# EAGLE design DAQ5 (EAGLE 9.6.2)
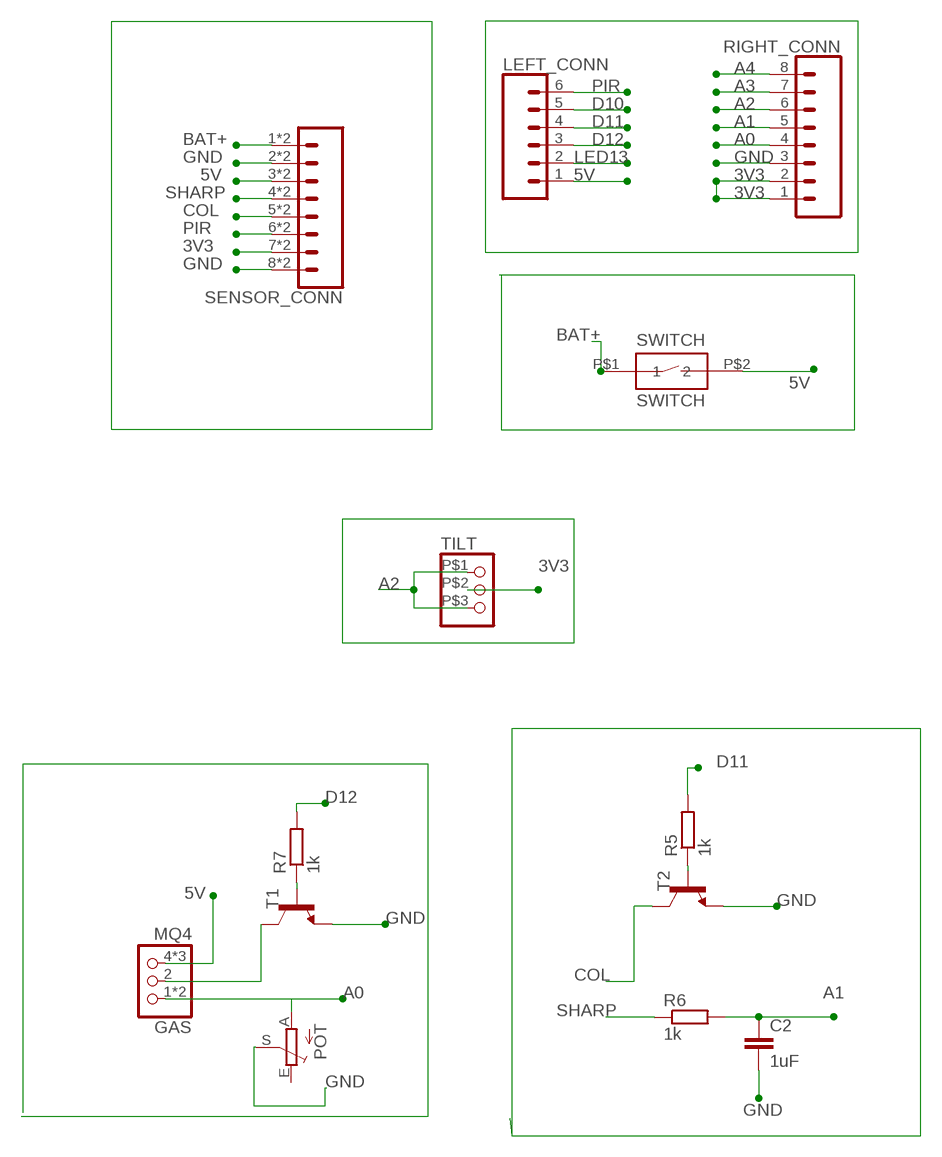
[diagram p0: schematic, sheet 1]

## Parts
C2  1uF  C5/2.5  [C5B2.5]
GAS  MQ4  [6PIN_MQ]
LEFT_CONN  CONN_06NO_SILK_FEMALE_PTH  [1X06_NO_SILK]
POT  TRIM_EU-B25P  [B25P]
R5  1k  R-EU_R1206  [R1206]
R6  1k  R-EU_R1206  [R1206]
R7  1k  R-EU_R1206  [R1206]
RIGHT_CONN  CONN_08NO_SILK_FEMALE_PTH  [1X08_NO_SILK]
SENSOR_CONN  CONN_08  [PHOENIX08]
SWITCH  SWITCH  [SWITCH]
T1  -NPN-TO92-EBC  [TO92-EBC]
T2  -NPN-TO92-EBC  [TO92-EBC]
TILT  TILT  [TILT]

## Nets
3V3: RIGHT_CONN.1 RIGHT_CONN.2 SENSOR_CONN.7 SENSOR_CONN.P$7 TILT.P$2
5V: GAS.4 GAS.5 GAS.6 LEFT_CONN.1 SENSOR_CONN.3 SENSOR_CONN.P$3 SWITCH.P$2
A0: GAS.1 GAS.3 POT.A RIGHT_CONN.4
A1: C2.1 R6.2 RIGHT_CONN.5
A2: RIGHT_CONN.6 TILT.P$1 TILT.P$3
A3: RIGHT_CONN.7
A4: RIGHT_CONN.8
BAT+: SENSOR_CONN.1 SENSOR_CONN.P$1 SWITCH.P$1
COL: SENSOR_CONN.5 SENSOR_CONN.P$5 T2.C
D10: LEFT_CONN.5
D11: LEFT_CONN.4 R5.2
D12: LEFT_CONN.3 R7.2
GND: C2.2 POT.S RIGHT_CONN.3 SENSOR_CONN.2 SENSOR_CONN.8 SENSOR_CONN.P$2 SENSOR_CONN.P$8 T1.E T2.E
LED13: LEFT_CONN.2
N$1: R5.1 T2.B
N$2: GAS.2 T1.C
N$5: R7.1 T1.B
PIR: LEFT_CONN.6 SENSOR_CONN.6 SENSOR_CONN.P$6
SHARP: R6.1 SENSOR_CONN.4 SENSOR_CONN.P$4
Unconnected: POT.E

## Library data of the parts
C2 = capacitor-wima:C: CAPACITOR naming: grid - package width
GAS = Pablo_DAQ:MQ4: Gas sensor breakout
LEFT_CONN = SparkFun-Connectors:CONN_06: Multi connection point. Often used as Generic Header-pin footprint for 0.1 inch spaced/style header connections On any of the 0.1 inch spaced packages, you can populate with these: Break Away Headers - Straight <https://www.sparkfun.com/products/116> (PRT-00116) Break Away Male Headers - Right Angle <https://www.sparkfun.com/products/553> (PRT-00553) Female Headers <https://www.sparkfun.com/products/115> (PRT-00115) Break Away Headers - Machine Pin <https://www.sparkfun.com/products/117> (PRT-00117) Break Away Female Headers - Swiss Machine Pin <https://www.sparkfun.com/products/743> (PRT-00743) Arduino Stackable Header - 6 Pin <https://www.sparkfun.com/products/9280> (PRT-09280) For SCREWTERMINALS and SPRING TERMINALS visit here: Screw Terimnals on SparkFun.com <https://www.sparkfun.com/search/results?term=Screw+Terminals> (5mm/3.5mm/2.54mm spacing) This device is also useful as a general connection point to wire up your design to another part of your project. Our various solder wires solder well into these plated through hole pads. Hook-Up Wire - Assortment (Stranded, 22 AWG) <https://www.sparkfun.com/products/11375> (PRT-11375) Hook-Up Wire - Assortment (Solid Core, 22 AWG) <https://www.sparkfun.com/products/11367> (PRT-11367) View the entire wire category on our website here <https://www.sparkfun.com/categories/141>; PROD_ID: CONN-08437
POT = Pablo_DAQ:TRIM_EU-: POTENTIOMETER
R5-R7 = Pablo_resistor:R-EU_: RESISTOR, European symbol
RIGHT_CONN = SparkFun-Connectors:CONN_08: Multi connection point. Often used as Generic Header-pin footprint for 0.1 inch spaced/style header connections On any of the 0.1 inch spaced packages, you can populate with these: Break Away Headers - Straight <https://www.sparkfun.com/products/116> (PRT-00116) Break Away Male Headers - Right Angle <https://www.sparkfun.com/products/553> (PRT-00553) Female Headers <https://www.sparkfun.com/products/115> (PRT-00115) Break Away Headers - Machine Pin <https://www.sparkfun.com/products/117> (PRT-00117) Break Away Female Headers - Swiss Machine Pin <https://www.sparkfun.com/products/743> (PRT-00743) Arduino Stackable Header - 8 Pin <https://www.sparkfun.com/products/9279> (PRT-09279) For SCREWTERMINALS and SPRING TERMINALS visit here: Screw Terimnals on SparkFun.com <https://www.sparkfun.com/search/results?term=Screw+Terminals> (5mm/3.5mm/2.54mm spacing) This device is also useful as a general connection point to wire up your design to another part of your project. Our various solder wires solder well into these plated through hole pads. Hook-Up Wire - Assortment (Stranded, 22 AWG) <https://www.sparkfun.com/products/11375> (PRT-11375) Hook-Up Wire - Assortment (Solid Core, 22 AWG) <https://www.sparkfun.com/products/11367> (PRT-11367) View the entire wire category on our website here <https://www.sparkfun.com/categories/141> Special notes: Molex polarized connector foot print use with SKU : PRT-08231 with associated crimp pins and housings. 1MM SMD Version SKU: PRT-10208 NOTES ON THE VARIANTS LOCK and LOCK_LONGPADS... This footprint was designed to help hold the alignment of a through-hole component (i.e. 6-pin header) while soldering it into place. You may notice that each hole has been shifted either up or down by 0.005 of an inch from it's more standard position (which is a perfectly straight line). This slight alteration caused the pins (the squares in the middle) to touch the edges of the holes. Because they are alternating, it causes a "brace" to hold the component in place. 0.005 has proven to be the perfect amount of "off-center" position when using our standard breakaway headers. Although looks a little odd when you look at the bare footprint, once you have a header in there, the alteration is very hard to notice. Also,if you push a header all the way into place, it is covered up entirely on the bottom side.; PROD_ID: CONN-08438
SENSOR_CONN = Pablo_DAQ:CONN_08: Multi connection point. Often used as Generic Header-pin footprint for 0.1 inch spaced/style header connections On any of the 0.1 inch spaced packages, you can populate with these: Break Away Headers - Straight <https://www.sparkfun.com/products/116> (PRT-00116) Break Away Male Headers - Right Angle <https://www.sparkfun.com/products/553> (PRT-00553) Female Headers <https://www.sparkfun.com/products/115> (PRT-00115) Break Away Headers - Machine Pin <https://www.sparkfun.com/products/117> (PRT-00117) Break Away Female Headers - Swiss Machine Pin <https://www.sparkfun.com/products/743> (PRT-00743) Arduino Stackable Header - 8 Pin <https://www.sparkfun.com/products/9279> (PRT-09279) For SCREWTERMINALS and SPRING TERMINALS visit here: Screw Terimnals on SparkFun.com <https://www.sparkfun.com/search/results?term=Screw+Terminals> (5mm/3.5mm/2.54mm spacing) This device is also useful as a general connection point to wire up your design to another part of your project. Our various solder wires solder well into these plated through hole pads. Hook-Up Wire - Assortment (Stranded, 22 AWG) <https://www.sparkfun.com/products/11375> (PRT-11375) Hook-Up Wire - Assortment (Solid Core, 22 AWG) <https://www.sparkfun.com/products/11367> (PRT-11367) View the entire wire category on our website here <https://www.sparkfun.com/categories/141> Special notes: Molex polarized connector foot print use with SKU : PRT-08231 with associated crimp pins and housings. 1MM SMD Version SKU: PRT-10208 NOTES ON THE VARIANTS LOCK and LOCK_LONGPADS... This footprint was designed to help hold the alignment of a through-hole component (i.e. 6-pin header) while soldering it into place. You may notice that each hole has been shifted either up or down by 0.005 of an inch from it's more standard position (which is a perfectly straight line). This slight alteration caused the pins (the squares in the middle) to touch the edges of the holes. Because they are alternating, it causes a "brace" to hold the component in place. 0.005 has proven to be the perfect amount of "off-center" position when using our standard breakaway headers. Although looks a little odd when you look at the bare footprint, once you have a header in there, the alteration is very hard to notice. Also,if you push a header all the way into place, it is covered up entirely on the bottom side.
SWITCH = Pablo_DAQ:SWITCH: Dip switch 1x1
T1 T2 = transistor:*-NPN-: NPN Transistror BF959 corrected 2008.03.06
TILT = Pablo_DAQ:TILT: TILT SENSOR

## Board
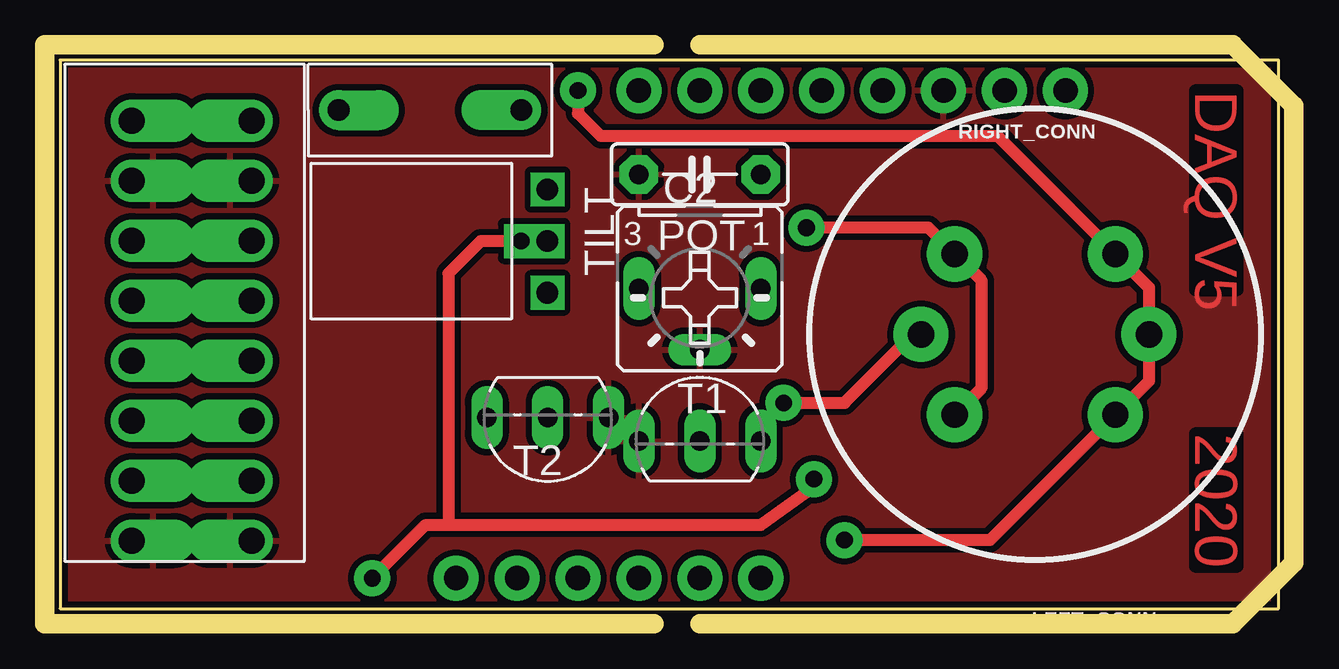
[diagram p1: board, top side]
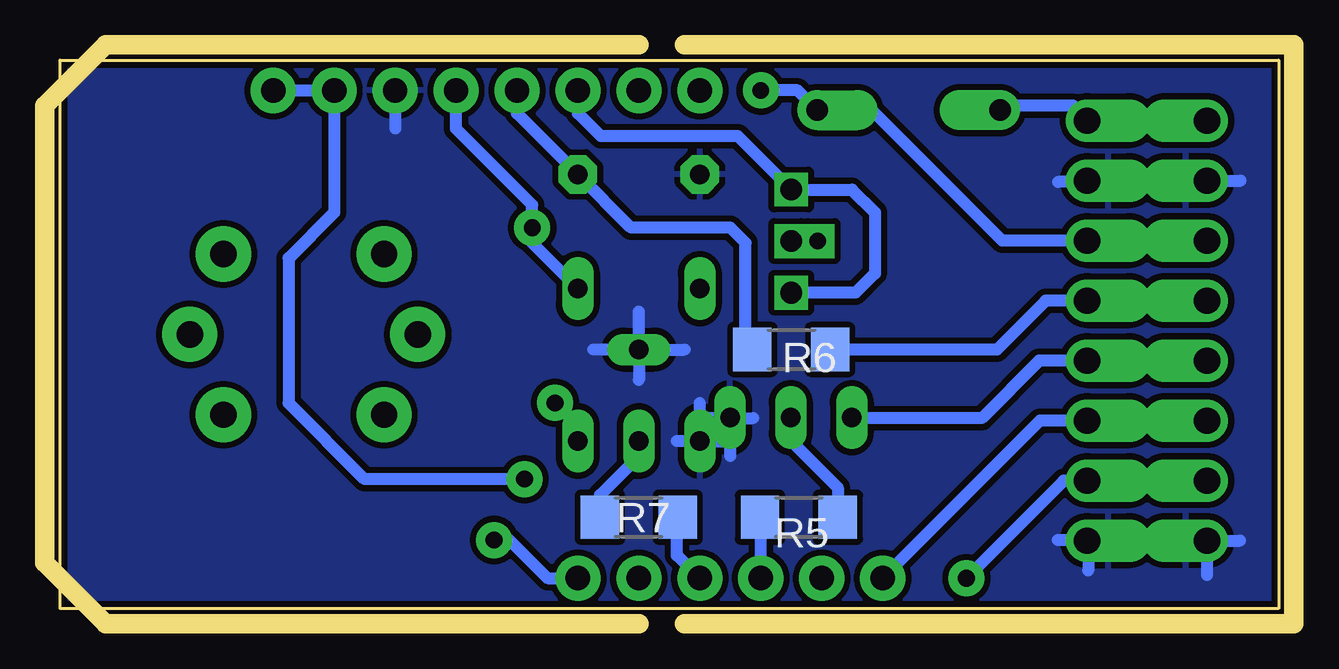
[diagram p2: board, bottom side, seen from below]

Size 50.8 x 22.86 mm. Coordinates in mm from the lower left corner, seen from the top.
Outline: 0,0 50.8,0 50.8,22.86 0,22.86 0,0
Copper layers (1*16): Top 0.035mm / dielectric 1.5mm / Bottom 0.035mm
Design rules "Pablo *": minimum track width 10mil, minimum drill 0.35mm, track to track 10mil, track to pad 10mil, pad to pad 10mil, via to via 10mil, smd to smd 0mil, copper to edge 10mil, drill to drill 10mil, minimum pad ring 10mil, minimum via ring 8mil, stop-mask expansion 4mil, vias tented up to drill 0mil, thermal gap 10mil
Milling: 8 lines

### Footprints (pad centres in the part's own frame; a part is rotated, then mirrored left to right if it is on the bottom)
C5B2.5 = drill 0.813 pad 1.6 octagon: 1 -2.54,0; 2 2.54,0
6PIN_MQ = drill 1.1 pad 2.3: 1 -3.35,3.35; 2 -4.75,0; 3 -3.35,-3.35; 4 3.35,-3.35; 5 4.75,0; 6 3.35,3.35
1X06_NO_SILK = drill 1.016 pad 1.88: 1 0,0; 2 2.54,0; 3 5.08,0; 4 7.62,0; 5 10.16,0; 6 12.7,0
B25P = drill 0.813 long: A -2.54,0; E 2.54,0; S 0,2.54
R1206 = smd 1.6 x 1.803: 1 -1.622,0; 2 1.622,0
1X08_NO_SILK = drill 1.016 pad 1.88: 1 0,0; 2 2.54,0; 3 5.08,0; 4 7.62,0; 5 10.16,0; 6 12.7,0; 7 15.24,0; 8 17.78,0
PHOENIX08 = drill 1.1 pad 1.778 offset: 1 2.35,7.8; 2 4.85,7.8; 3 7.35,7.8; 4 9.85,7.8; 5 12.35,7.8; 6 14.85,7.8; 7 17.35,7.8; 8 19.85,7.8; P$1 2.35,2.8; P$2 4.85,2.8; P$3 7.35,2.8; P$4 9.85,2.8; P$5 12.35,2.8; P$6 14.85,2.8; P$7 17.35,2.8; P$8 19.85,2.8
SWITCH = drill 0.9 pad 1.676 offset: P$1 0,0; P$2 7.62,0
TO92-EBC = drill 0.813 long: B 0,-1.27; C 2.54,-1.27; E -2.54,-1.27
TILT = drill 0.9 square: P$1 0,0; P$2 2.15,0; P$3 4.3,0

### Placement (x,y rotation side)
C2  26.67,18.1 180 top
GAS  40.64,11.43 0 top
LEFT_CONN  29.21,1.27 180 top
POT  26.67,13.34 180 top
R5  20,3.81 180 bottom
R6  20.32,10.79 180 bottom
R7  26.67,3.81 0 bottom
RIGHT_CONN  41.91,21.59 180 top
SENSOR_CONN  0.19,22.68 270 top
SWITCH  11.62,20.77 0 top
T1  26.67,8.26 0 top
T2  20.33,6.69 180 top
TILT  20.32,17.46 270 top

### Tracks (layer width: path | path; a pad name or v marks a point on that pad's centre or on a via)
3V3  (via drill 0.7 pad 1.41, 0.7 pad 1.5)
  Top 0.508: v31.43,5.4 31.43,5.08 29.21,3.49 16.19,3.49 | v19.21,15.31 17.54,15.31 16.19,13.97 16.19,3.49 | v13.02,1.27 15.24,3.49 16.19,3.49
  Bottom 0.508: SENSOR_CONN.P$7 SENSOR_CONN.7 8.96,5.33 v13.02,1.27 | RIGHT_CONN.1 RIGHT_CONN.2 39.37,16.51 41.27,14.61 41.27,8.57 38.1,5.4 v31.43,5.4 | v19.21,15.31 TILT.P$2
5V  (via drill 0.7 pad 1.5)
  Top 0.508: v32.7,2.86 38.77,2.86 GAS.4 45.39,9.48 GAS.5 45.39,13.38 GAS.6 39.09,19.68 22.54,19.68 21.59,20.64 v21.59,21.59
  Bottom 0.508: v32.7,2.86 32.07,2.86 30.48,1.27 LEFT_CONN.1 | v21.59,21.59 20.05,21.59 SWITCH.P$2 16.96,20.77 11.52,15.33 SENSOR_CONN.3 SENSOR_CONN.P$3
A0  (via drill 0.7 pad 1.5)
  Top 0.508: GAS.3 38.42,9.21 38.42,13.65 GAS.1 36.2,15.88 v31.11,15.88
  Bottom 0.508: POT.A 31.11,15.24 v31.11,15.88 31.11,16.83 34.29,20 RIGHT_CONN.4
A1
  Bottom 0.508: 21.91,10.76 R6.2 21.94,11.15 22.23,11.43 22.23,15.24 22.86,15.88 26.99,15.88 C2.1 31.75,20.64 RIGHT_CONN.5
A2
  Bottom 0.508: RIGHT_CONN.6 29.21,20.64 28.26,19.68 22.54,19.68 TILT.P$1 17.78,17.46 16.83,16.51 16.83,13.97 17.64,13.16 TILT.P$3
BAT+
  Bottom 0.508: SWITCH.P$1 11.43,20.95 8.57,20.95 8.57,20.91 SENSOR_CONN.1 SENSOR_CONN.P$1
COL
  Bottom 0.508: SENSOR_CONN.P$5 SENSOR_CONN.5 9.99,10.33 12.38,7.94 17.77,7.94 T2.C
D11
  Bottom 0.508: LEFT_CONN.4 21.59,3.78 R5.2
D12
  Bottom 0.508: LEFT_CONN.3 25.08,2.22 25.08,3.78 R7.2
GND
  Bottom 0.508: SENSOR_CONN.2 SENSOR_CONN.P$2 1.59,17.83 | POT.S 26.67,12.38 | POT.S 28.57,10.79 | POT.S 26.67,9.53 | POT.S 24.77,10.79 | SENSOR_CONN.8 7.94,2.78 7.94,1.59 | SENSOR_CONN.2 7.94,17.88 | SENSOR_CONN.2 7.94,17.78 | RIGHT_CONN.3 36.83,20 | T1.E 24.13,7.94 | 24.13,7.94 24.13,8.57 | T1.E 23.18,6.99 | T1.E 25.08,6.99 | SENSOR_CONN.8 7.94,2.88 | SENSOR_CONN.8 8.02,2.86 9.21,2.86 | 1.61,2.83 SENSOR_CONN.P$8 2.99,1.4 | SENSOR_CONN.2 7.99,17.78 9.2,17.78 | T2.E 22.85,7.94 21.91,7.94 | T2.E 22.87,6.36 22.86,6.35 | T2.E 22.86,7.97 | T2.E 22.89,7.94 24.13,7.94
  pour Bottom (rank 6): 50.8,22.86 0,22.86 0,0 50.8,0
  pour Top: 0,0 0,22.86 50.8,22.86 50.8,0
N$1
  Bottom 0.508: T2.B 20.33,7 18.38,5.04 R5.1
N$2  (via drill 0.7 pad 1.5)
  Top 0.508: GAS.2 35.56,11.43 32.7,8.57 v30.16,8.57
  Bottom 0.508: T1.C 29.21,7.62 v30.16,8.57
N$5
  Bottom 0.508: R7.1 28.29,4.73 26.67,6.35 T1.B
PIR
  Bottom 0.508: SENSOR_CONN.P$6 SENSOR_CONN.6 9.95,7.83 LEFT_CONN.6
SHARP
  Bottom 0.508: SENSOR_CONN.P$4 SENSOR_CONN.4 9.71,12.83 11.75,10.79 R6.1

### Text on the board
Top: DAQ V5 | 2020